# EAGLE schematic Project datacommunicatie (EAGLE 9.6.0)
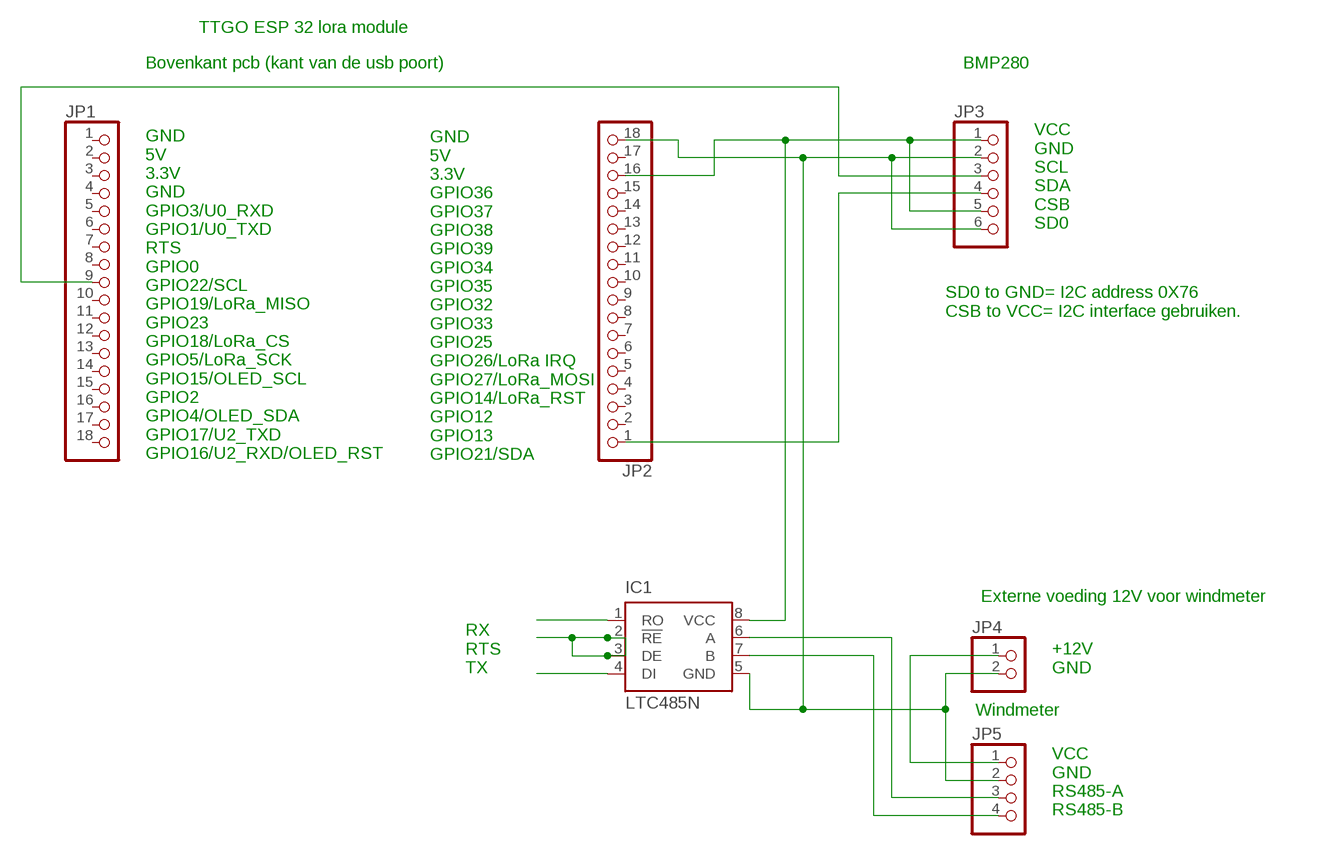
[diagram p0: schematic, sheet 1]

## Parts
IC1  LTC485N  [DIL08]
JP1  PINHD-1X18  [1X18]
JP2  PINHD-1X18  [1X18]
JP3  PINHD-1X6  [1X06]
JP4  PINHD-1X2  [1X02]
JP5  PINHD-1X4  [1X04]

## Nets
N$1: JP2.1 JP3.4
N$2: JP1.9 JP3.3
N$4: IC1.5(GND) JP2.18 JP3.2 JP3.6 JP4.2 JP5.2
N$5: IC1.2(!RE) IC1.3(DE)
N$6: IC1.8(VCC) JP2.16 JP3.1 JP3.5
N$7: JP4.1 JP5.1
N$8: IC1.6(A) JP5.3
N$9: IC1.7(B) JP5.4
N$10: IC1.1(RO)
N$11: IC1.4(DI)
Unconnected: JP1.1 JP1.2 JP1.3 JP1.4 JP1.5 JP1.6 JP1.7 JP1.8 JP1.10 JP1.11 JP1.12 JP1.13 JP1.14 JP1.15 JP1.16 JP1.17 JP1.18 JP2.2 JP2.3 JP2.4 JP2.5 JP2.6 JP2.7 JP2.8 JP2.9 JP2.10 JP2.11 JP2.12 JP2.13 JP2.14 JP2.15 JP2.17

## Notes on the sheet
- TTGO ESP 32 lora module
- Bovenkant pcb (kant van de usb poort) | BMP280
- VCC
  GND
  SCL
  SDA
  CSB
  SD0
- SD0 to GND= I2C address 0X76
  CSB to VCC= I2C interface gebruiken.
- GND
  5V
  3.3V
  GPIO36
  GPIO37
  GPIO38
  GPIO39
  GPIO34
  GPIO35
  GPIO32
  GPIO33
  GPIO25
  GPIO26/LoRa IRQ
  GPIO27/LoRa_MOSI
  GPIO14/LoRa_RST
  GPIO12
  GPIO13
  GPIO21/SDA
- GND
  5V
  3.3V
  GND
  GPIO3/U0_RXD
  GPIO1/U0_TXD
  RTS
  GPIO0
  GPIO22/SCL
  GPIO19/LoRa_MISO
  GPIO23
  GPIO18/LoRa_CS
  GPIO5/LoRa_SCK
  GPIO15/OLED_SCL
  GPIO2
  GPIO4/OLED_SDA
  GPIO17/U2_TXD
  GPIO16/U2_RXD/OLED_RST
- Externe voeding 12V voor windmeter
- RX
  RTS
  TX
- +12V
  GND
- Windmeter
- VCC
  GND
  RS485-A
  RS485-B

## Library data of the parts
IC1 = linear-technology:LTC485: Low Power RS485 Interface Transceiver Source: http://www.linear.com/pc/downloadDocument.do?navId=H0,C1,C1007,C1017,P2064,D1718; OC_FARNELL: unknown; OC_NEWARK: unknown
JP1 JP2 = pinhead:PINHD-1X18: PIN HEADER
JP3 = pinhead:PINHD-1X6: PIN HEADER
JP4 = pinhead:PINHD-1X2: PIN HEADER
JP5 = pinhead:PINHD-1X4: PIN HEADER